# EAGLE schematic Diseño_de_FISICA_v14 (EAGLE 9.7.0)
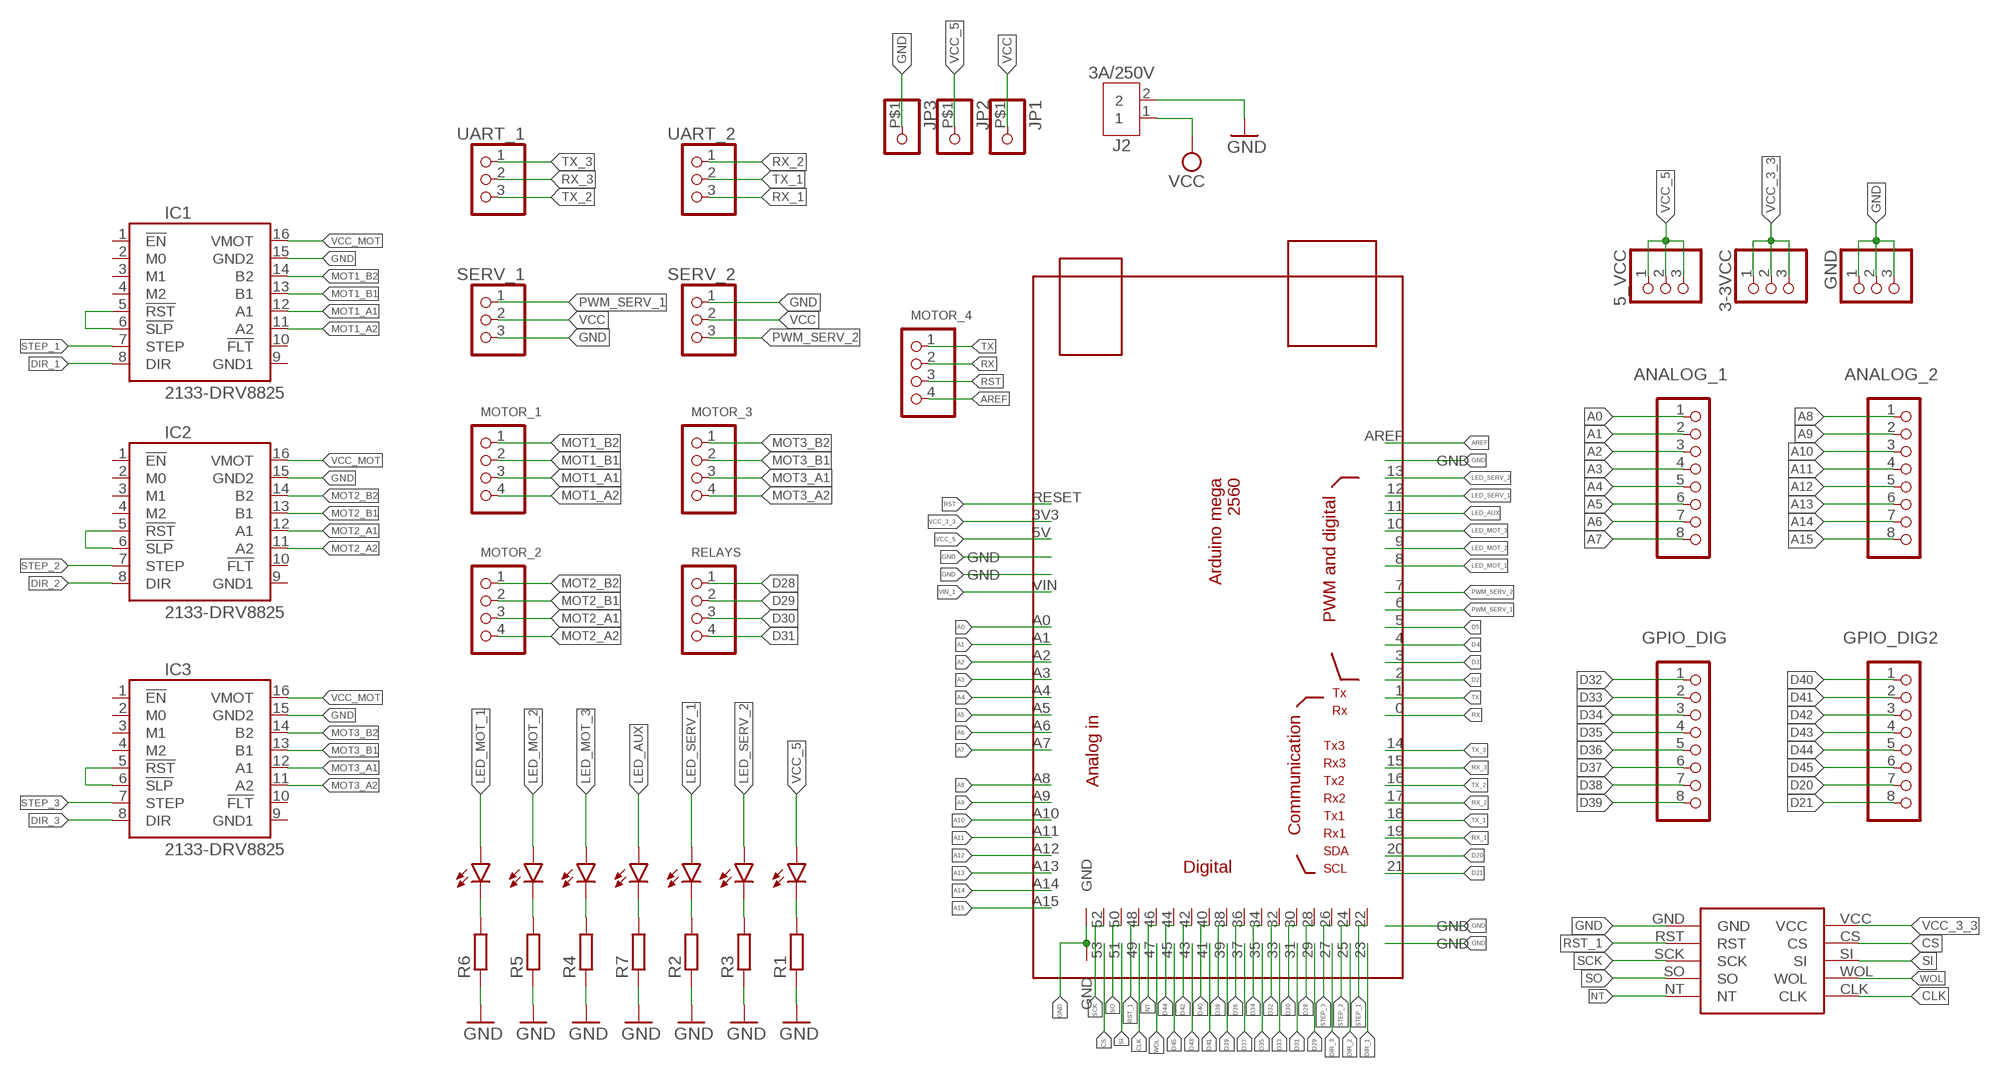
[diagram p0: schematic, sheet 1]

## Parts
3-3VCC  PINHD-1X3  [1X03]
5_VCC  PINHD-1X3  [1X03]
ANALOG_1  PINHD-1X8  [1X08]
ANALOG_2  PINHD-1X8  [1X08]
ARDUINOMEGA2560  MEGA_DEVICE  [MEGAOUTLINE]
GND  PINHD-1X3  [1X03]
GPIO_DIG  PINHD-1X8  [1X08]
GPIO_DIG2  PINHD-1X8  [1X08]
IC1  2133-DRV8825  [DRV8825]
IC2  2133-DRV8825  [DRV8825]
IC3  2133-DRV8825  [DRV8825]
J2  3A/250V  B2B-XH-A  [B2B-XH-A]
JP1  PINHD-1X1-BIGPOGO  [1X1-BIGPOGO]
JP2  PINHD-1X1-BIGPOGO  [1X1-BIGPOGO]
JP3  PINHD-1X1-BIGPOGO  [1X1-BIGPOGO]
LED_AUX  LED_RED  LED_RADIAL_RED  [LEDRD254W60D565H860B]
LED_MOT1  LED_RED  LED_RADIAL_RED  [LEDRD254W60D565H860B]
LED_MOT2  LED_RED  LED_RADIAL_RED  [LEDRD254W60D565H860B]
LED_MOT3  LED_RED  LED_RADIAL_RED  [LEDRD254W60D565H860B]
LED_ON  LED_RED  LED_RADIAL_RED  [LEDRD254W60D565H860B]
LED_SERV1  LED_RED  LED_RADIAL_RED  [LEDRD254W60D565H860B]
LED_SERV2  LED_RED  LED_RADIAL_RED  [LEDRD254W60D565H860B]
MODULO_ETHERNET  ENC28J60  [ENC28J60]
MOTOR_1  PINHD-1X4  [1X04]
MOTOR_2  PINHD-1X4  [1X04]
MOTOR_3  PINHD-1X4  [1X04]
MOTOR_4  PINHD-1X4  [1X04]
R1  R_CHIP-0805(2012-METRIC)  [RESC2012X65]
R2  R_CHIP-0805(2012-METRIC)  [RESC2012X65]
R3  R_CHIP-0805(2012-METRIC)  [RESC2012X65]
R4  R_CHIP-0805(2012-METRIC)  [RESC2012X65]
R5  R_CHIP-0805(2012-METRIC)  [RESC2012X65]
R6  R_CHIP-0805(2012-METRIC)  [RESC2012X65]
R7  R_CHIP-0805(2012-METRIC)  [RESC2012X65]
RELAYS  PINHD-1X4  [1X04]
SERV_1  PINHD-1X3  [1X03]
SERV_2  PINHD-1X3  [1X03]
UART_1  PINHD-1X3  [1X03]
UART_2  PINHD-1X3  [1X03]

## Nets
A0: ANALOG_1.1 ARDUINOMEGA2560.A0
A1: ANALOG_1.2 ARDUINOMEGA2560.A1
A2: ANALOG_1.3 ARDUINOMEGA2560.A2
A3: ANALOG_1.4 ARDUINOMEGA2560.A3
A4: ANALOG_1.5 ARDUINOMEGA2560.A4
A5: ANALOG_1.6 ARDUINOMEGA2560.A5
A6: ANALOG_1.7 ARDUINOMEGA2560.A6
A7: ANALOG_1.8 ARDUINOMEGA2560.A7
A8: ANALOG_2.1 ARDUINOMEGA2560.A8
A9: ANALOG_2.2 ARDUINOMEGA2560.A9
A10: ANALOG_2.3 ARDUINOMEGA2560.A10
A11: ANALOG_2.4 ARDUINOMEGA2560.A11
A12: ANALOG_2.5 ARDUINOMEGA2560.A12
A13: ANALOG_2.6 ARDUINOMEGA2560.A13
A14: ANALOG_2.7 ARDUINOMEGA2560.A14
A15: ANALOG_2.8 ARDUINOMEGA2560.A15
AREF: ARDUINOMEGA2560.AREF MOTOR_4.4
CLK: ARDUINOMEGA2560.49 MODULO_ETHERNET.CLK
CS: ARDUINOMEGA2560.53 MODULO_ETHERNET.CS
D2: ARDUINOMEGA2560.2
D3: ARDUINOMEGA2560.3
D4: ARDUINOMEGA2560.4
D5: ARDUINOMEGA2560.5
D20: ARDUINOMEGA2560.20 GPIO_DIG2.7
D21: ARDUINOMEGA2560.21 GPIO_DIG2.8
D28: ARDUINOMEGA2560.28 RELAYS.1
D29: ARDUINOMEGA2560.29 RELAYS.2
D30: ARDUINOMEGA2560.30 RELAYS.3
D31: ARDUINOMEGA2560.31 RELAYS.4
D32: ARDUINOMEGA2560.32 GPIO_DIG.1
D33: ARDUINOMEGA2560.33 GPIO_DIG.2
D34: ARDUINOMEGA2560.34 GPIO_DIG.3
D35: ARDUINOMEGA2560.35 GPIO_DIG.4
D36: ARDUINOMEGA2560.36 GPIO_DIG.5
D37: ARDUINOMEGA2560.37 GPIO_DIG.6
D38: ARDUINOMEGA2560.38 GPIO_DIG.7
D39: ARDUINOMEGA2560.39 GPIO_DIG.8
D40: ARDUINOMEGA2560.40 GPIO_DIG2.1
D41: ARDUINOMEGA2560.41 GPIO_DIG2.2
D42: ARDUINOMEGA2560.42 GPIO_DIG2.3
D43: ARDUINOMEGA2560.43 GPIO_DIG2.4
D44: ARDUINOMEGA2560.44 GPIO_DIG2.5
D45: ARDUINOMEGA2560.45 GPIO_DIG2.6
DIR_1: ARDUINOMEGA2560.23 IC1.8(DIR)
DIR_2: ARDUINOMEGA2560.25 IC2.8(DIR)
DIR_3: ARDUINOMEGA2560.27 IC3.8(DIR)
GND: ARDUINOMEGA2560.GND@1(GND) ARDUINOMEGA2560.GND@2(GND) ARDUINOMEGA2560.GND@3(GND) ARDUINOMEGA2560.GND@4(GND) ARDUINOMEGA2560.GND@5(GND) ARDUINOMEGA2560.GND@6(GND) ARDUINOMEGA2560.GND@7(GND) GND.1 GND.2 GND.3 IC1.15(GND2) IC2.15(GND2) IC3.15(GND2) J2.2 JP3.P$1 MODULO_ETHERNET.GND R1.1 R2.1 R3.1 R4.1 R5.1 R6.1 R7.1 SERV_1.3 SERV_2.1
LED_AUX: ARDUINOMEGA2560.11 LED_AUX.1(A)
LED_MOT_1: ARDUINOMEGA2560.8 LED_MOT1.1(A)
LED_MOT_2: ARDUINOMEGA2560.9 LED_MOT2.1(A)
LED_MOT_3: ARDUINOMEGA2560.10 LED_MOT3.1(A)
LED_SERV_1: ARDUINOMEGA2560.12 LED_SERV1.1(A)
LED_SERV_2: ARDUINOMEGA2560.13 LED_SERV2.1(A)
MOT1_A1: IC1.12(A1) MOTOR_1.3
MOT1_A2: IC1.11(A2) MOTOR_1.4
MOT1_B1: IC1.13(B1) MOTOR_1.2
MOT1_B2: IC1.14(B2) MOTOR_1.1
MOT2_A1: IC2.12(A1) MOTOR_2.3
MOT2_A2: IC2.11(A2) MOTOR_2.4
MOT2_B1: IC2.13(B1) MOTOR_2.2
MOT2_B2: IC2.14(B2) MOTOR_2.1
MOT3_A1: IC3.12(A1) MOTOR_3.3
MOT3_A2: IC3.11(A2) MOTOR_3.4
MOT3_B1: IC3.13(B1) MOTOR_3.2
MOT3_B2: IC3.14(B2) MOTOR_3.1
N$7: IC2.5(!RST) IC2.6(!SLP)
N$8: IC1.5(!RST) IC1.6(!SLP)
N$9: IC3.5(!RST) IC3.6(!SLP)
N$20: LED_ON.2(C) R1.2
N$21: LED_SERV1.2(C) R2.2
N$22: LED_SERV2.2(C) R3.2
N$23: LED_MOT3.2(C) R4.2
N$24: LED_MOT2.2(C) R5.2
N$25: LED_MOT1.2(C) R6.2
N$37: LED_AUX.2(C) R7.2
NT: ARDUINOMEGA2560.46 MODULO_ETHERNET.NT
PWM_SERV_1: ARDUINOMEGA2560.6 SERV_1.1
PWM_SERV_2: ARDUINOMEGA2560.7 SERV_2.3
RST: ARDUINOMEGA2560.RESET MOTOR_4.3
RST_1: ARDUINOMEGA2560.48 MODULO_ETHERNET.RST
RX: ARDUINOMEGA2560.0 MOTOR_4.2
RX_1: ARDUINOMEGA2560.19 UART_2.3
RX_2: ARDUINOMEGA2560.17 UART_2.1
RX_3: ARDUINOMEGA2560.15 UART_1.2
SCK: ARDUINOMEGA2560.52 MODULO_ETHERNET.SCK
SI: ARDUINOMEGA2560.51 MODULO_ETHERNET.SI
SO: ARDUINOMEGA2560.50 MODULO_ETHERNET.SO
STEP_1: ARDUINOMEGA2560.22 IC1.7(STEP)
STEP_2: ARDUINOMEGA2560.24 IC2.7(STEP)
STEP_3: ARDUINOMEGA2560.26 IC3.7(STEP)
TX: ARDUINOMEGA2560.1 MOTOR_4.1
TX_1: ARDUINOMEGA2560.18 UART_2.2
TX_2: ARDUINOMEGA2560.16 UART_1.3
TX_3: ARDUINOMEGA2560.14 UART_1.1
VCC: J2.1 JP1.P$1 SERV_1.2 SERV_2.2
VCC_3_3: 3-3VCC.1 3-3VCC.2 3-3VCC.3 ARDUINOMEGA2560.3V3 MODULO_ETHERNET.VCC
VCC_5: 5_VCC.1 5_VCC.2 5_VCC.3 ARDUINOMEGA2560.5V JP2.P$1 LED_ON.1(A)
VCC_MOT: IC1.16(VMOT) IC2.16(VMOT) IC3.16(VMOT)
VIN_1: ARDUINOMEGA2560.VIN
WOL: ARDUINOMEGA2560.47 MODULO_ETHERNET.WOL
Unconnected: IC1.1(!EN) IC1.2(M0) IC1.3(M1) IC1.4(M2) IC1.10(!FLT) IC2.1(!EN) IC2.2(M0) IC2.3(M1) IC2.4(M2) IC2.10(!FLT) IC3.1(!EN) IC3.2(M0) IC3.3(M1) IC3.4(M2) IC3.10(!FLT)

## Power pins joined to a net without a drawn wire
GND1: IC1.9(GND1) IC2.9(GND1) IC3.9(GND1)

## Library data of the parts
3-3VCC 5_VCC GND SERV_1 SERV_2 UART_1 UART_2 = Connector:PINHD-1X3: PIN HEADER; CATEGORY: CONNECTOR; SUB-CATEGORY: PIN-HEADER
ANALOG_1 ANALOG_2 GPIO_DIG GPIO_DIG2 = Connector:PINHD-1X8: PIN HEADER; CATEGORY: CONNECTOR; SUB-CATEGORY: PIN-HEADER
ARDUINOMEGA2560 = ArduinoMegaOutline:MEGA_DEVICE: mega card as device
IC1-IC3 = pololu-stepper-driver:2133-DRV8825: DRV8825 Stepper Motor Driver Carrier, High Current #2133 DRV8825 Stepper Motor Driver Carrier; High Current <https://www.pololu.com/product/2133> in Japan, Suzaku Lab. Ltd. <https://suzakugiken.jp/> #2133 DRV8825 大電流用ステッピングモータドライバ <https://szc.jp/po2133>
J2 = Connector:B2B-XH-A: XH Connector Top Entry - 2POS Details see: Datasheet <http://www.jst-mfg.com/product/pdf/eng/eXH.pdf>; CATEGORY: CONNECTOR; DESCRIPTION: 2.5mm pitch/disconnectable crimp style connector; MANUFACTURER: JST (XH CONNECTOR); MPN: B2B-XH-A; OPERATING_TEMPERATURE: -25°C ~ 85°C; PART_STATUS: ACTIVE; ROHS_COMPLIANT: COMPLIANT; SERIES: B_B-XH-A; SUB_CATEGORY: Through hole connector; TYPE: top entry
JP1-JP3 = adafruit:PINHD-1X1: Pin header 1x1 for 0.1" spacing With round pins
LED_AUX LED_MOT1-LED_MOT3 LED_ON LED_SERV1 LED_SERV2 = Opto-Electronic:LED_RADIAL: LED - Generic; CATEGORY: Opto-Electronic; SUB-CATEGORY: LED
MODULO_ETHERNET = ethernet-mikroavr:ENC28J60: ENC28J60, SHIELD EHTERNET, CREATE BY MIKROAVR.COM
MOTOR_1-MOTOR_4 RELAYS = Connector:PINHD-1X4: PIN HEADER; CATEGORY: CONNECTOR; SUB-CATEGORY: PIN-HEADER
R1-R7 = Resistor:R: Resistor Fixed - Generic; CATEGORY: Resistor; SUB-CATEGORY: Fixed